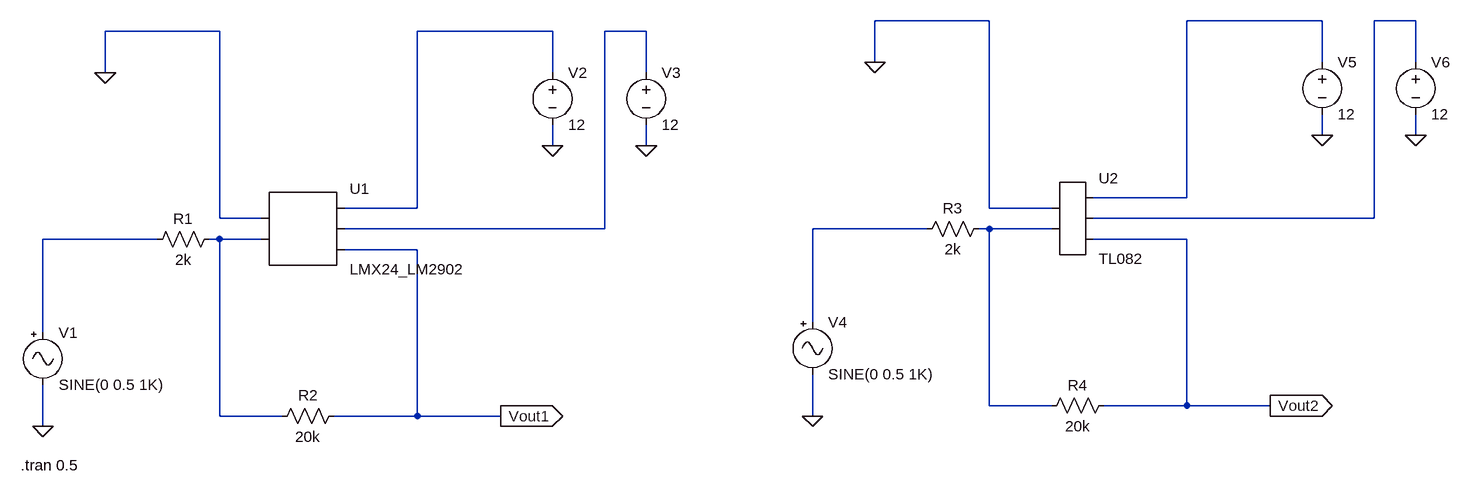
[diagram p0: schematic SimulacaoRelatorio1Parte2.asc]
SimulacaoRelatorio1Parte2.asc, the LTspice schematic file:
Version 4
SHEET 1 2024 680
WIRE 1312 -112 1136 -112
WIRE 1824 -112 1616 -112
WIRE 1968 -112 1904 -112
WIRE 128 -96 -48 -96
WIRE 640 -96 432 -96
WIRE 784 -96 720 -96
WIRE 1136 -48 1136 -112
WIRE 1824 -48 1824 -112
WIRE 1968 -48 1968 -112
WIRE -48 -32 -48 -96
WIRE 640 -32 640 -96
WIRE 784 -32 784 -96
WIRE 1824 64 1824 32
WIRE 1968 64 1968 32
WIRE 640 80 640 48
WIRE 784 80 784 48
WIRE 1616 160 1616 -112
WIRE 1616 160 1472 160
WIRE 432 176 432 -96
WIRE 432 176 320 176
WIRE 1312 176 1312 -112
WIRE 1408 176 1312 176
WIRE 128 192 128 -96
WIRE 192 192 128 192
WIRE 1904 192 1904 -112
WIRE 1904 192 1472 192
WIRE 720 208 720 -96
WIRE 720 208 320 208
WIRE 1216 208 1040 208
WIRE 1312 208 1296 208
WIRE 1408 208 1312 208
WIRE 32 224 -144 224
WIRE 128 224 112 224
WIRE 192 224 128 224
WIRE 1616 224 1472 224
WIRE 432 240 320 240
WIRE 1040 352 1040 208
WIRE -144 368 -144 224
WIRE 1312 480 1312 208
WIRE 1408 480 1312 480
WIRE 1616 480 1616 224
WIRE 1616 480 1488 480
WIRE 1744 480 1616 480
WIRE 128 496 128 224
WIRE 224 496 128 496
WIRE 432 496 432 240
WIRE 432 496 304 496
WIRE 560 496 432 496
WIRE 1040 496 1040 432
WIRE -144 512 -144 448
FLAG -144 512 0
FLAG -48 -32 0
FLAG 560 496 Vout1
IOPIN 560 496 Out
FLAG 640 80 0
FLAG 784 80 0
FLAG 1040 496 0
FLAG 1136 -48 0
FLAG 1744 480 Vout2
IOPIN 1744 480 Out
FLAG 1824 64 0
FLAG 1968 64 0
SYMBOL AutoGenerated\\LMX24_LM2902 256 208 R0
SYMATTR InstName U1
SYMBOL res 320 480 R90
WINDOW 0 0 56 VBottom 2
WINDOW 3 32 56 VTop 2
SYMATTR InstName R2
SYMATTR Value 20k
SYMBOL res 128 208 R90
WINDOW 0 0 56 VBottom 2
WINDOW 3 32 56 VTop 2
SYMATTR InstName R1
SYMATTR Value 2k
SYMBOL Misc\\signal -144 352 R0
SYMATTR InstName V1
SYMATTR Value SINE(0 0.5 1K)
SYMBOL voltage 640 -48 R0
SYMATTR InstName V2
SYMATTR Value 12
SYMBOL voltage 784 -48 R0
SYMATTR InstName V3
SYMATTR Value 12
SYMBOL res 1504 464 R90
WINDOW 0 0 56 VBottom 2
WINDOW 3 32 56 VTop 2
SYMATTR InstName R4
SYMATTR Value 20k
SYMBOL res 1312 192 R90
WINDOW 0 0 56 VBottom 2
WINDOW 3 32 56 VTop 2
SYMATTR InstName R3
SYMATTR Value 2k
SYMBOL voltage 1824 -64 R0
SYMATTR InstName V5
SYMATTR Value 12
SYMBOL voltage 1968 -64 R0
SYMATTR InstName V6
SYMATTR Value 12
SYMBOL Misc\\signal 1040 336 R0
SYMATTR InstName V4
SYMATTR Value SINE(0 0.5 1K)
SYMBOL AutoGenerated\\TL082 1440 192 R0
SYMATTR InstName U2
TEXT -178 572 Left 2 !.tran 0.5

The netlist it stands for:
* SimulacaoRelatorio1Parte2.asc
* U1: LMX24_LM2902 (symbol AutoGenerated\LMX24_LM2902 not available, pins judged from their places): pin1=0 pin2=N008 pin3=N003 pin4=N004 pin5=Vout1
R2 Vout1 N008 20k
R1 N008 N007 2k
V1 N007 0 SINE(0 0.5 1K)
V2 N003 0 12
V3 N004 0 12
R4 Vout2 N006 20k
R3 N006 N005 2k
V5 N001 0 12
V6 N002 0 12
V4 N005 0 SINE(0 0.5 1K)
* U2: TL082 (symbol AutoGenerated\TL082 not available, pins judged from their places): pin1=0 pin2=N006 pin3=N001 pin4=N002 pin5=Vout2
.tran 0.5
.backanno
.end